# EAGLE design N_MD2_2 (EAGLE 9.6.2)
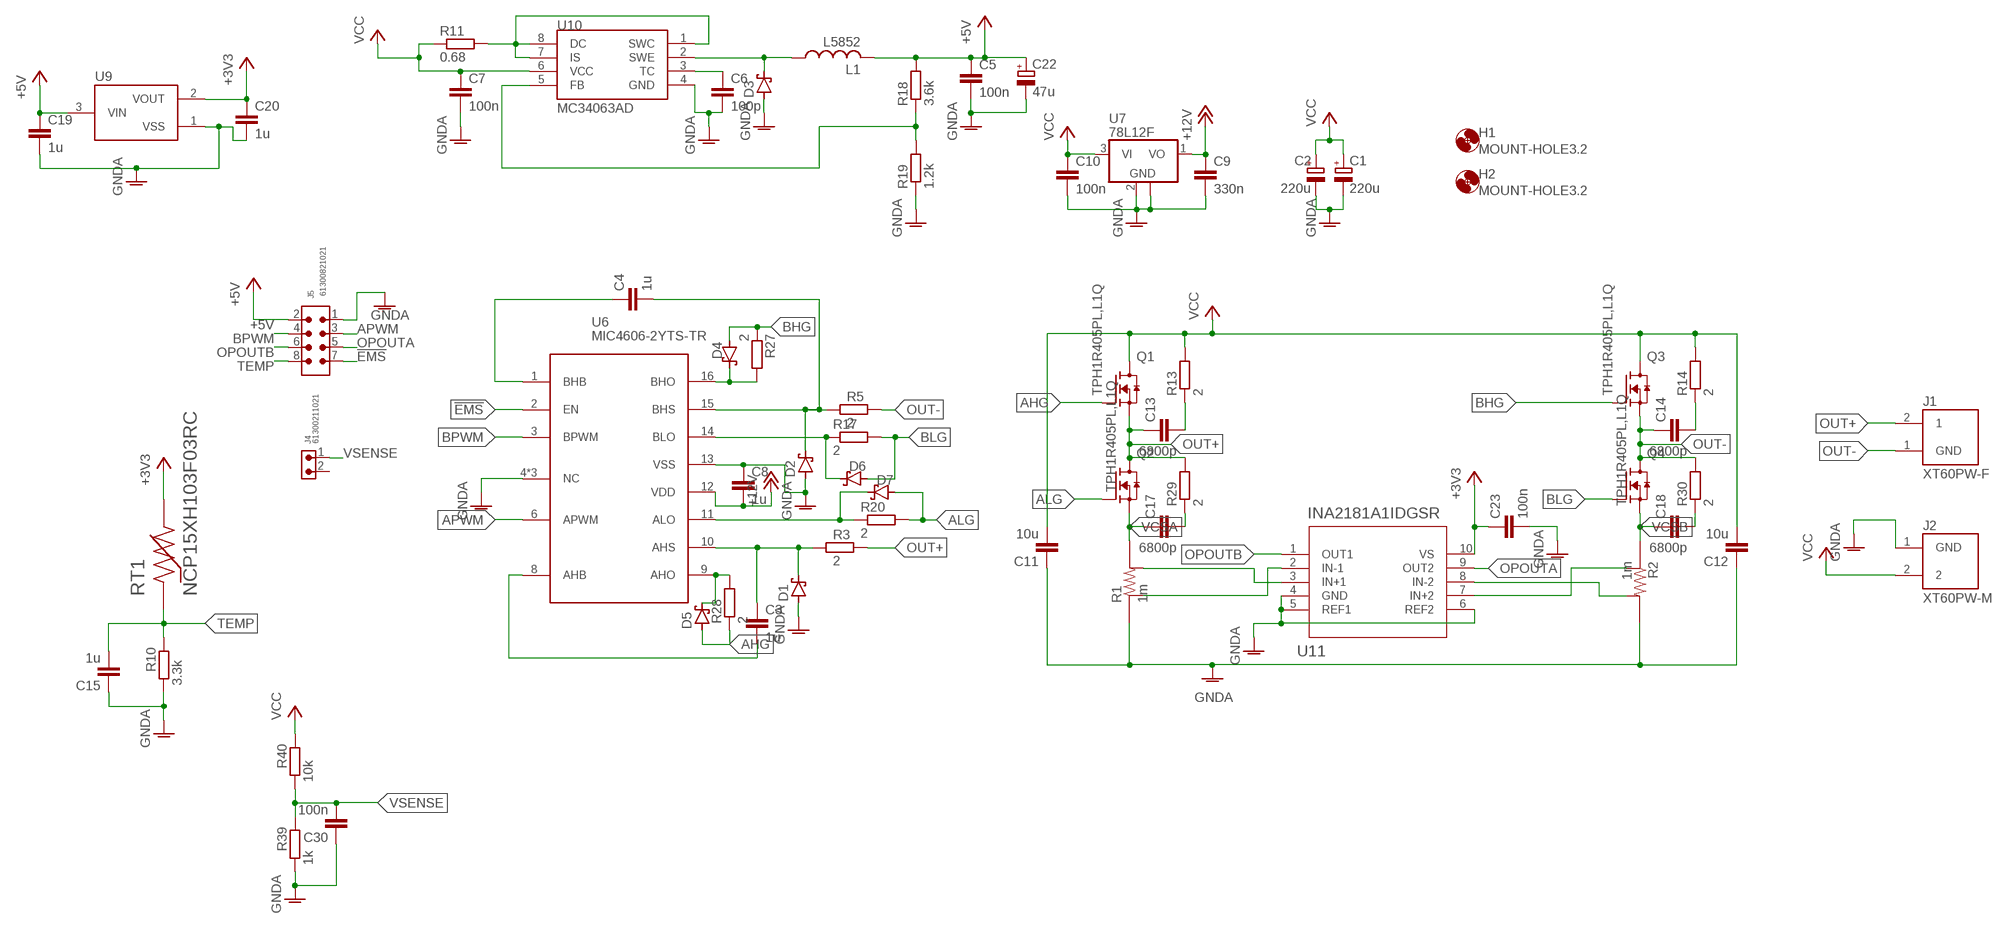
[diagram p0: schematic, sheet 1]

## Parts
C1  220u  CPOL-EUE5-10.5  [E5-10,5]
C2  220u  CPOL-EUE5-10.5  [E5-10,5]
C3  1u  C-EUC0603  [C0603]
C4  1u  C-EUC0603  [C0603]
C5  100n  C-EUC0603  [C0603]
C6  100p  C-EUC0603  [C0603]
C7  100n  C-EUC0603  [C0603]
C8  1u  C-EUC0603  [C0603]
C9  330n  C-EUC0603  [C0603]
C10  100n  C-EUC0603  [C0603]
C11  10u  C-EUC1210  [C1210]
C12  10u  C-EUC1210  [C1210]
C13  6800p  C-EUC0603  [C0603]
C14  6800p  C-EUC0603  [C0603]
C15  1u  C-EUC0603  [C0603]
C17  6800p  C-EUC0603  [C0603]
C18  6800p  C-EUC0603  [C0603]
C19  1u  C-EUC0603  [C0603]
C20  1u  C-EUC0603  [C0603]
C22  47u  CPOL-EUE2.5-5  [E2,5-5]
C23  100n  C-EUC0603  [C0603]
C30  100n  C-EUC0603  [C0603]
D1  PMEG6010CEJ,115  [SOD323_ST]
D2  PMEG6010CEJ,115  [SOD323_ST]
D3  PMEG6010CEJ,115  [SOD323_ST]
D4  PMEG6010CEJ,115  [SOD323_ST]
D5  PMEG6010CEJ,115  [SOD323_ST]
D6  PMEG6010CEJ,115  [SOD323_ST]
D7  PMEG6010CEJ,115  [SOD323_ST]
H1  MOUNT-HOLE3.2  [3,2]
H2  MOUNT-HOLE3.2  [3,2]
J1  XT60PW-F  [AMASS_XT60PW-F]
J2  XT60PW-M  [AMASS_XT60PW-M]
J4  61300211021  6130XX11021_61300211021  [61300211021]
J5  61300821021  6130XX21021_61300821021  [61300821021]
L1  L5852  [L5852]
Q1  TPH1R405PL,L1Q  [SOPADVANCE]
Q2  TPH1R405PL,L1Q  [SOPADVANCE]
Q3  TPH1R405PL,L1Q  [SOPADVANCE]
Q4  TPH1R405PL,L1Q  [SOPADVANCE]
R1  1m  R2512  [2512-4PAD]
R2  1m  R2512  [2512-4PAD]
R3  2  R-EU_R0603  [R0603]
R5  2  R-EU_R0603  [R0603]
R10  3.3k  R-EU_R0603  [R0603]
R11  0.68  R-EU_R1206  [R1206]
R13  2  R-EU_R0603  [R0603]
R14  2  R-EU_R0603  [R0603]
R17  2  R-EU_R0603  [R0603]
R18  3.6k  R-EU_R0603  [R0603]
R19  1.2k  R-EU_R0603  [R0603]
R20  2  R-EU_R0603  [R0603]
R27  2  R-EU_R0603  [R0603]
R28  2  R-EU_R0603  [R0603]
R29  2  R-EU_R0603  [R0603]
R30  2  R-EU_R0603  [R0603]
R39  1k  R-EU_R0603  [R0603]
R40  10k  R-EU_R0603  [R0603]
RT1  NCP15XH103F03RC  [THRMC1005X55N]
U6  MIC4606-2YTS-TR  [TSSOP16]
U7  78L12F  [SOT89]
U9  XC6206  [SOT95P240X110-3]
U10  MC34063AD  [SOIC8]
U11  INA2181A1IDGSR  [DGS10]

## Nets
!EMS: J5.7 U6.2(EN)
+3V3: C20.1 C23.1 RT1.2 U9.2(VOUT) U11.10(VS)
+5V: C5.1 C19.1 C22.+ J5.2 L1.P$2 R18.2 U9.3(VIN)
+12V: C8.2 C9.1 U6.12(VDD) U7.1(VO)
AHG: D5.A Q1.4(G) R28.1
ALG: D7.A Q2.4(G) R20.2
APWM: J5.3 U6.6(APWM)
BHG: D4.A Q3.4(G) R27.1
BLG: D6.A Q4.4(G) R17.2
BPWM: J5.4 U6.3(BPWM)
GNDA: C1.- C2.- C5.2 C6.2 C7.2 C8.1 C9.2 C10.2 C11.1 C12.1 C15.1 C19.2 C20.2 C22.- C23.2 C30.1 D1.A D2.A D3.A J2.1(GND) J5.1 R1.1 R1.2 R2.3 R2.4 R10.1 R19.1 R39.1 U6.4(NC) U6.5(NC) U6.7(NC) U6.13(VSS) U7.2(GND) U7.2@1(GND) U9.1(VSS) U10.4(GND) U11.4(GND) U11.5(REF1) U11.6(REF2)
N$1: C17.2 R29.1
N$2: C18.2 R30.1
N$3: C3.1 D1.C R3.1 U6.10(AHS)
N$4: C3.2 U6.8(AHB)
N$5: C4.2 D2.C R5.1 U6.15(BHS)
N$8: C4.1 U6.1(BHB)
N$18: C14.2 R14.1
N$19: D6.C R17.1 U6.14(BLO)
N$20: C13.2 R13.1
N$21: D7.C R20.1 U6.11(ALO)
N$22: R1.6 U11.3(IN+1)
N$23: R2.5 U11.7(IN+2)
N$26: D3.C L1.P$1 U10.2(SWE)
N$27: C6.1 U10.3(TC)
N$28: R18.1 R19.2 U10.5(FB)
N$29: R2.6 U11.8(IN-2)
N$30: R11.2 U10.1(SWC) U10.7(IS) U10.8(DC)
N$31: R1.5 U11.2(IN-1)
N$32: D4.C R27.2 U6.16(BHO)
N$33: D5.C R28.2 U6.9(AHO)
OPOUTA: J5.5 U11.9(OUT2)
OPOUTB: J5.6 U11.1(OUT1)
OUT+: C13.1 J1.2 Q1.1(S) Q1.2(S) Q1.3(S) Q2.5(D) Q2.6(D) Q2.7(D) Q2.8(D) Q2.9(D) R3.2 R29.2
OUT-: C14.1 J1.1(GND) Q3.1(S) Q3.2(S) Q3.3(S) Q4.5(D) Q4.6(D) Q4.7(D) Q4.8(D) Q4.9(D) R5.2 R30.2
TEMP: C15.2 J5.8 R10.2 RT1.1
VCC: C1.+ C2.+ C7.1 C10.1 C11.2 C12.2 J2.2 Q1.5(D) Q1.6(D) Q1.7(D) Q1.8(D) Q1.9(D) Q3.5(D) Q3.6(D) Q3.7(D) Q3.8(D) Q3.9(D) R11.1 R13.2 R14.2 R40.2 U7.3(VI) U10.6(VCC)
VCSA: C17.1 Q2.1(S) Q2.2(S) Q2.3(S) R1.3 R1.4
VCSB: C18.1 Q4.1(S) Q4.2(S) Q4.3(S) R2.1 R2.2
VSENSE: C30.2 J4.1 R39.2 R40.1
Unconnected: J4.2

## Library data of the parts
C1 C2 C22 = rcl:CPOL-EU: POLARIZED CAPACITOR, European symbol; SPICEPREFIX: C
C3-C15 C17-C20 C23 C30 = rcl:C-EU: CAPACITOR, European symbol; SPICEPREFIX: C
D1-D7 = nexperia:PMEG6010CEJ,115: Schottky barrier diode
H1 H2 = holes:MOUNT-HOLE: MOUNTING HOLE with drill center marker
J1 = con-xt:XT60PW-F
J2 = con-xt:XT60PW-M; AVAILABILITY: Unavailable; MF: AMASS; MP: XT60PW-M; PACKAGE: Package Analog Devices; PRICE: None
J4 = Wurth_Connectors_WR-PHD:6130XX11021_61300211021: WR-PHD 2.54 mm THT Angled Pin Header ARTICLE PROPERTIES: Pins:2;​ 3;​ 4;​ 5;​ 6;​ 7;​ 8;​ 9;​ 10;​ 12;​ 14;​ 16;​ 18;​ 22;​ 32;​ 34;​ 36;​ 40 KIND PROPERTIES: Pitch：2.54 mm Quality Class:3 as per CECC 75 301-802 Rows：Single Gender：Pin Header Type：Angled MATERIAL PROPERTIES: Insulator Material :PA6T Insulator Flammability Rating:UL94 V-0 Contact Material:Copper Alloy Contact Plating:Gold Contact Type:Stamped GENERAL INFORMATION Operating Temperature:-40 up to +105 °C Compliance:Lead free / RoHS ELECTRICAL PROPERTIES: Rated Current:3 A IR 1:3 A Withstanding Voltage:500 V (AC) Contact Resistance:20 mΩ RISO:1000 MΩ CERTIFICATION UL Approval:E323964 PACKAGING PROPERTIES Packaging:Bag <https://katalog.we-online.com/media/images/v2/o33210v209%20Family_WR-PHD_6130xx11021.jpg> Details see: https://katalog.we-online.com/en/em/PHD_2_54_THT_ANGLED_PIN_HEADER_6130XX11021 Updated by Yingchun,Shan 2019-10-16 2019 (C) Würth Elektronik; DATASHEET-URL: https://www.we-online.com/catalog/datasheet/61300211021.pdf; GENDER: Pin Header; IR: 3A; MOUNT: THT; PACKAGING: Bag; PART-NUMBER: 61300211021; PINS: 2; PITCH: 2.54mm; ROWS: Single; TYPE: Angled
J5 = Wurth_Connectors_WR-PHD:6130XX21021_61300821021: WR-PHD 2.54 mm THT Angled Dual Pin Header ARTICLE PROPERTIES: Pins:4;​ 6;​ 8;​ 10;​ 12;​ 14;​ 16;​ 18;​ 20;​ 22;​ 24;​ 26;​ 32;​ 34;​ 36;​ 40;​ 64;​ 72 KIND PROPERTIES: Pitch：2.54 mm Quality Class:3 as per CECC 75 301-802 Rows：Dual Gender：Pin Header Type：Angled;​ Board Stacker MATERIAL PROPERTIES: Insulator Material :PA6T Insulator Flammability Rating:UL94 V-0 Contact Material:Copper Alloy Contact Plating:Gold Contact Type:Stamped GENERAL INFORMATION Operating Temperature:-40 up to +105 °C Compliance:RoHS ELECTRICAL PROPERTIES: Rated Current:3 A IR 1:3 A Withstanding Voltage:500 V (AC) Contact Resistance:20 mΩ RISO:1000 MΩ CERTIFICATION UL Approval:E323964 PACKAGING PROPERTIES Packaging:Bag <https://katalog.we-online.com/media/images/v2/o33214v209%20Family_wr-phd_6130XX21021.jpg> Details see: https://katalog.we-online.com/en/em/PHD_2_54_THT_ANGLED_DUAL_PIN_HEADER_6130XX21021 Updated by Yingchun,Shan 2019-10-16 2019 (C) Würth Elektronik; DATASHEET-URL: https://www.we-online.com/catalog/datasheet/61300821021.pdf; GENDER: Pin Header; IR: 3A; MOUNT: THT; PACKAGING: Bag; PART-NUMBER: 61300821021; PINS: 8; PITCH: 2.54mm; ROWS: Dual; TYPE: Angled
L1 = inductors:L5852
Q1-Q4 = toshiba:TPH1R405PL,L1Q
R1 R2 = shunt-resistor:R2512
R3 R5 R10 R11 R13 R14 R17-R20 R27-R30 R39 R40 = rcl:R-EU_: RESISTOR, European symbol; SPICEPREFIX: R
RT1 = NCP15XH103F03RC:NCP15XH103F03RC: NTC Thermistor 10k 0402 (1005 Metric) Check prices <https://pricing.snapeda.com/parts/NCP15XH103F03RC/Murata/view-part?ref=eda>; AVAILABILITY: Good; DESCRIPTION: NTC Thermistor 10k 0402 (1005 Metric); MF: Murata; MP: NCP15XH103F03RC; PACKAGE: 1005 Taiyo Yuden; PRICE: None; PURCHASE-URL: https://pricing.snapeda.com/search/part/NCP15XH103F03RC/?ref=eda
U6 = Microchip:MIC4606-2YTS-TR
U7 = linear:78L*: POSITOIV-VOLTAGE REGULATORS Output up to 100 mA Source: Datasheet <http://focus.ti.com/lit/ds/symlink/ua78l05.pdf>
U9 = torex:XC6206
U10 = mc34063:MC34063
U11 = texas-instruments:INA2181A1IDGSR; BUILT_BY: EMA_Jessica; COPYRIGHT: Copyright (C) 2018 Accelerated Designs. All rights reserved; MANUFACTURER_PART_NUMBER: INA2181A1IDGSR; VENDOR: Texas Instruments

## Board
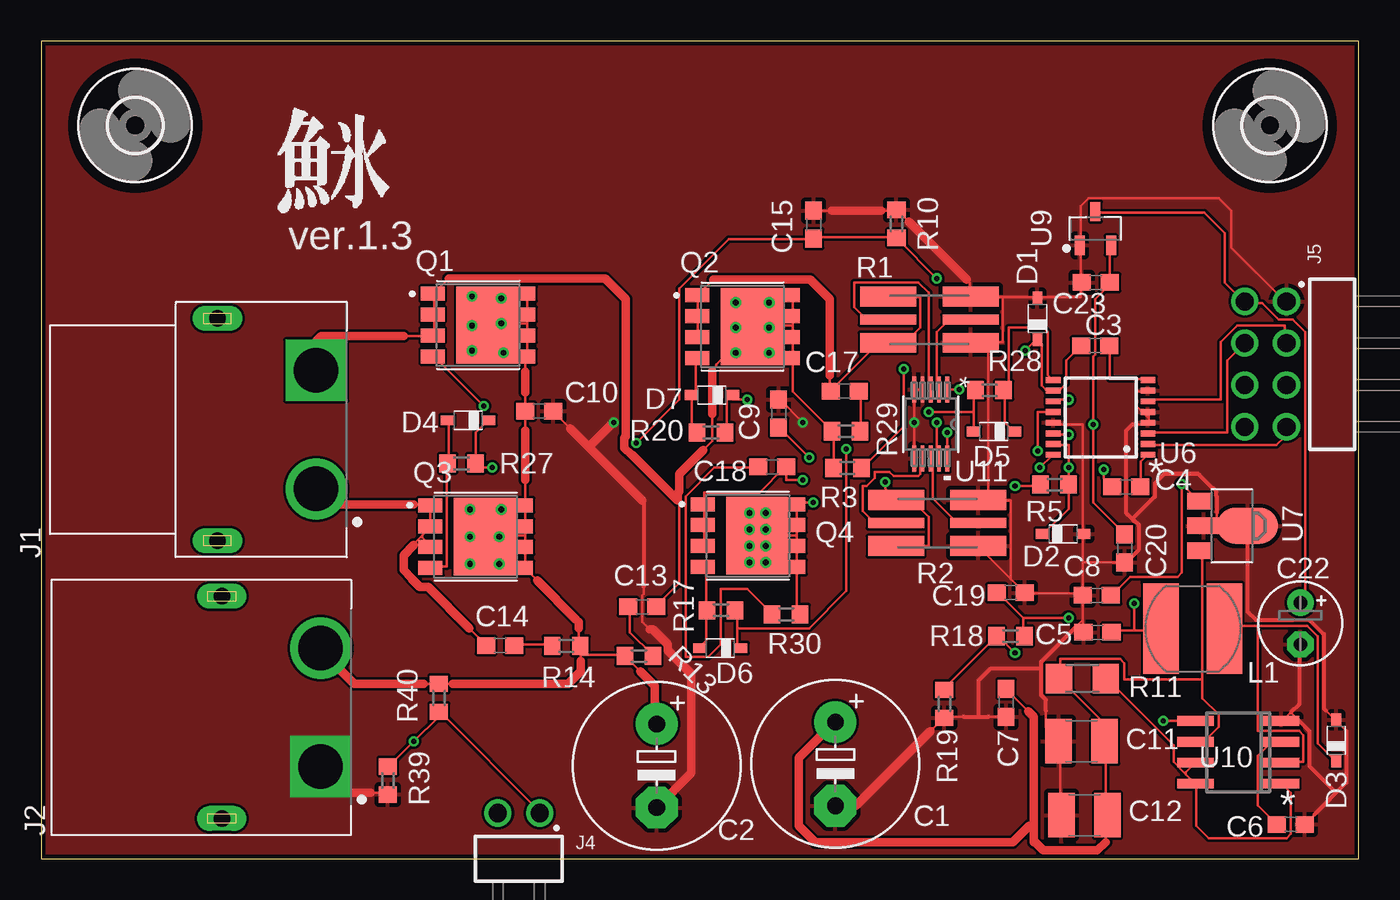
[diagram p1: board, top side]
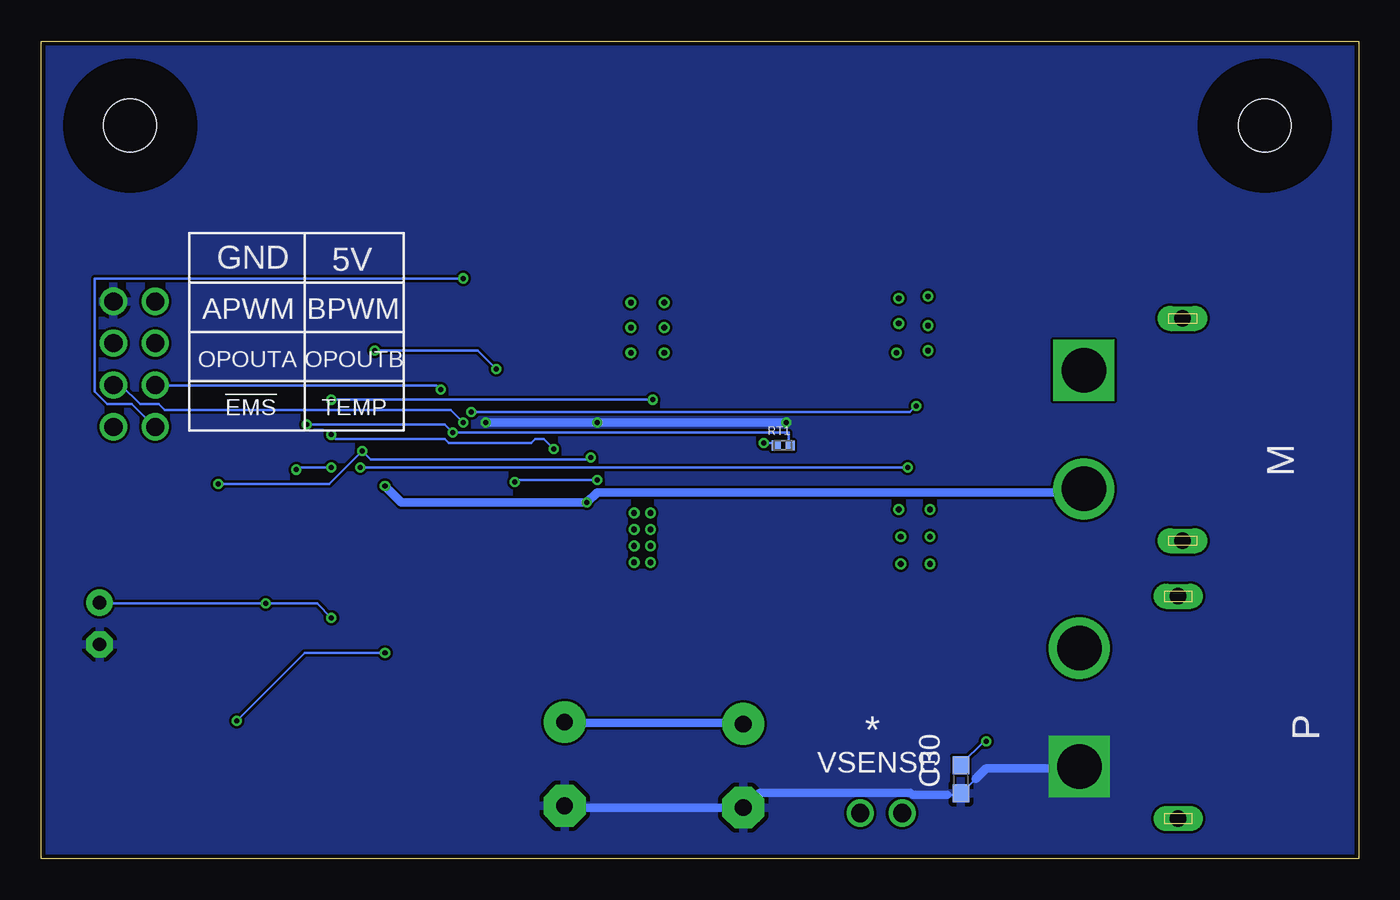
[diagram p2: board, bottom side, seen from below]

Size 80 x 49.66 mm. Coordinates in mm from the lower left corner, seen from the top.
Outline: 0,0 80,0 80,49.66 0,49.66 0,0
Copper layers (1*16): Top 0.035mm / dielectric 1.5mm / Bottom 0.035mm
Design rules "SeeedStudio_2layer_DRU_no_angle_20140221": minimum track width 6mil, minimum drill 12mil, track to track 6mil, track to pad 6mil, pad to pad 6mil, via to via 6mil, smd to smd 0mil, copper to edge 10mil, drill to drill 10mil, minimum pad ring 10mil, minimum via ring 6mil, stop-mask expansion 2mil, vias tented up to drill 100mil, thermal gap 10mil

### Footprints (pad centres in the part's own frame; a part is rotated, then mirrored left to right if it is on the bottom)
E5-10,5 = drill 1.016 pad 2.54: + -2.54,0 | drill 1.016 pad 2.54 octagon: - 2.54,0
C0603 = smd 1.1 x 1: 1 -0.85,0; 2 0.85,0
C1210 = smd 1.6 x 2.7: 1 -1.4,0; 2 1.4,0
E2,5-5 = drill 0.813 pad 1.6: + -1.27,0 | drill 0.813 pad 1.6 octagon: - 1.27,0
SOD323_ST = smd 0.8 x 0.6: A 1.25,0; C -1.25,0
3,2 = hole 3.2: 0,0
AMASS_XT60PW-F = drill 2.7: 1 -3.6,-6 | drill 2.7 square: 2 3.6,-6 | drill 1 pad 1.2 long: S1 -6.75,0; S2 6.75,0
AMASS_XT60PW-M = drill 2.7 square: 1 -3.6,-6 | drill 2.7: 2 3.6,-6 | drill 1 pad 1.2 long: S1 -6.75,0; S2 6.75,0
61300211021 = drill 1.1: 1 1.27,2.77; 2 -1.27,2.77
61300821021 = drill 1.1: 1 3.81,2.77; 2 3.81,5.31; 3 1.27,2.77; 4 1.27,5.31; 5 -1.27,2.77; 6 -1.27,5.31; 7 -3.81,2.77; 8 -3.81,5.31
L5852 = smd 2.15 x 5.5: P$1 1.925,0; P$2 -1.925,0
SOPADVANCE = smd 1.45 x 0.85: 1 -2.75,1.905; 2 -2.75,0.635; 3 -2.75,-0.635; 4 -2.75,-1.905 | smd 1.05 x 0.85: 5 2.95,-1.905; 6 2.95,-0.635; 7 2.95,0.635; 8 2.95,1.905 | smd 3.75 x 4.7: 9 0.55,0
2512-4PAD = smd 3.4 x 1.2: 1 -2.5,1.4; 2 -2.5,-1.4; 3 2.5,1.4; 4 2.5,-1.4 | smd 3.4 x 0.6: 5 -2.5,0; 6 2.5,0
R0603 = smd 1 x 1.1: 1 -0.85,0; 2 0.85,0
R1206 = smd 1.6 x 1.803: 1 -1.422,0; 2 1.422,0
THRMC1005X55N = smd 0.54 x 0.6: 1 -0.432,0; 2 0.432,0
TSSOP16 = smd 0.9 x 0.35: 1 -2.875,2.275; 2 -2.875,1.625; 3 -2.875,0.975; 4 -2.875,0.325; 5 -2.875,-0.325; 6 -2.875,-0.975; 7 -2.875,-1.625; 8 -2.875,-2.275; 9 2.875,-2.275; 10 2.875,-1.625; 11 2.875,-0.975; 12 2.875,-0.325; 13 2.875,0.325; 14 2.875,0.975; 15 2.875,1.625; 16 2.875,2.275
SOT89 = smd 1 x 1.5: 1 -1.499,-1.981; 3 1.499,-1.981 | smd 1 x 2: 2 0,-1.727 | smd 2.2 x 3.7: 2@1 0,0.94
SOT95P240X110-3 = smd 1.18 x 0.609: 1 -1.024,0.95; 2 -1.024,-0.95; 3 1.024,0
SOIC8 = smd 0.6 x 2.2: 1 -1.905,-2.6; 2 -0.635,-2.6; 3 0.635,-2.6; 4 1.905,-2.6; 5 1.905,2.6; 6 0.635,2.6; 7 -0.635,2.6; 8 -1.905,2.6
DGS10 = smd 1.575 x 0.229: 1 -2.095,1; 2 -2.095,0.5; 3 -2.095,0; 4 -2.095,-0.5; 5 -2.095,-1; 6 2.095,-1; 7 2.095,-0.5; 8 2.095,0; 9 2.095,0.5; 10 2.095,1

### Placement (x,y rotation side)
C1  48.22,5.75 270 top
C2  37.37,5.64 270 top
C3  63.99,31.15 0 top
C4  65.88,22.58 180 top
C5  64.14,13.76 180 top
C6  75.86,2.07 0 top
C7  58.58,9.47 270 top
C8  64.09,15.99 0 top
C9  44.78,27.04 90 top
C10  30.25,27.18 0 top
C11  63.17,7.13 0 top
C12  63.34,2.64 0 top
C13  36.5,15.29 180 top
C14  27.87,12.94 0 top
C15  46.89,38.51 270 top
C17  48.78,28.39 0 top
C18  44.39,23.8 180 top
C19  58.87,16.15 0 top
C20  65.79,18.83 270 top
C22  76.45,14.28 270 top
C23  64.03,34.99 180 top
C30  24.16,4.82 90 bottom
D1  60.49,32.8 90 top
D2  62.04,19.73 0 top
D3  78.62,7.19 90 top
D4  25.92,26.63 180 top
D5  57.85,25.95 180 top
D6  41.23,12.79 180 top
D7  40.72,28.17 180 top
H1  74.6,44.53 0 top
H2  5.71,44.53 0 top
J1  10.7,26.06 90 top
J2  10.97,9.19 90 top
J4  29,0 0 top
J5  78.38,30.04 90 top
L1  69.91,13.97 0 top
Q1  26.53,32.42 0 top
Q2  42.58,32.32 0 top
Q3  26.38,19.56 0 top
Q4  42.92,19.62 0 top
R1  53.93,32.74 180 top
R2  54.41,20.39 0 top
R3  48.94,23.74 180 top
R5  61.53,22.72 180 top
R10  51.93,38.56 270 top
R11  63.21,10.94 0 top
R13  36.29,12.31 180 top
R14  31.88,12.93 0 top
R17  41.28,15.09 180 top
R18  58.85,13.52 0 top
R19  54.84,9.4 90 top
R20  40.67,25.88 180 top
R27  25.52,24.01 0 top
R28  57.58,28.46 0 top
R29  48.86,25.96 180 top
R30  45.23,14.84 0 top
R39  21.05,4.74 90 top
R40  24.15,9.77 90 top
RT1  34.95,25.09 0 bottom
U6  64.32,26.81 180 top
U7  72.31,20.21 270 top
U9  64.01,38.28 90 top
U10  72.68,6.47 90 top
U11  54.01,26.39 270 top

### Tracks (layer width: path | path; a pad name or v marks a point on that pad's centre or on a via)
!EMS
  Top 0.152: U6.2 67.25,25.12 75,25.12 75.5,25.62 75.5,26.12 J5.7
+3V3  (via drill 0.3)
  Top 0.152: U9.2 64.88,37.25 C23.1 64.88,34.88 64,34 64,30.62 63.88,30.5 v63.88,26.38 63.88,21.62 65.75,19.75 C20.1 | v55,25.88 55,24.38 U11.10
  Bottom 0.152: v63.88,26.38 55.5,26.38 v55,25.88 34.62,25.88 34.62,25.2 RT1.2
+5V  (via drill 0.3)
  Top 0.152: U9.3 64.12,39.25 70.62,39.25 71.88,38 71.88,35 73,33.88 J5.2 73.12,33.75 74.12,33.75 75.12,32.75 76,32.75 76.75,32 76.75,15.88 76.5,15.62 C22.+ | 66.38,13.88 67.88,13.88 L1.P$2 | 66.38,13.88 65,13.88 C5.1 | 59.62,14.62 58.12,16.12 C19.1 | 59.62,14.62 59.62,13.62 R18.2 | v62.38,14.62 59.62,14.62 | v66.38,15.5 66.38,13.88
  Bottom 0.152: v62.38,14.62 63.25,15.5 v66.38,15.5 76.38,15.5 C22.+
+12V  (via drill 0.3)
  Top 0.152: v60.5,24.75 60.5,27.12 61.38,27.12 U6.12 | U7.1 70.25,21.75 v69.25,22.75 69.25,17.38 69,17.12 66.12,17.12 65,16 C8.2 | v46.62,24.38 44.88,26.12 C9.1
  Bottom 0.152: v69.25,22.75 62.5,22.75 v60.5,24.75 60,24.25 46.75,24.25 v46.62,24.38
AHG  (via drill 0.3)
  Top 0.152: 56.62,27.12 56.62,28.38 R28.1 | 56.62,27.12 56.62,26 D5.A | v26.88,27.5 23.88,30.5 Q1.4 | 56.62,27.12 v53.88,27.12
  Bottom 0.152: v26.88,27.5 27.25,27.12 v53.88,27.12
ALG
  Top 0.152: Q2.4 39.75,30.38 39.75,28.5 39.5,28.25 D7.A 39.5,28.12 39.5,26.25 39.75,26 R20.2
APWM
  Top 0.152: U6.6 67.25,27.88 71.62,27.88 71.62,31.38 72.62,32.38 75.5,32.38 75.5,31.38 J5.3
BHG
  Top 0.152: D4.A 24.75,26.62 24.75,24.12 R27.1 24.62,24 24.62,17.75 23.75,17.75 Q3.4
BLG
  Top 0.152: D6.A 40,12.88 40.38,13.25 40.38,15 R17.2 40.38,15.12 40.38,17.5 40.25,17.62 Q4.4
BPWM
  Top 0.152: U6.3 67.25,25.88 72,25.88 72,30.25 73,31.25 J5.4
GNDA  (via drill 0.3)
  Top 0.152: 20,4 21,4 R39.1 | v46.25,26.5 44.88,27.88 C9.2 | U11.6 53,24.38 v53,26.5 53,28.38 U11.5 U11.4 | 36.5,21.75 33.25,25 32.12,26.12 31.12,27.12 C10.2 | 36.94,13.94 36.5,14.38 36.5,16 36.58,16.08 36.58,16.51 | 37.38,3.12 C2.- | 34.62,26.38 v34.75,26.5 | 51,39.38 51.88,39.38 R10.1 52,39.38 52.69,38.69 | 48,39.38 47,39.38 C15.1 | 56.19,35.19 56.38,35 56.38,34.25 R1.2 56.5,34.12 58.38,34.12 | 58.38,34.12 60.38,34.12 D1.A 60.5,34.12 63.12,34.12 63.12,34.88 C23.2 63.12,35 63.12,37.25 U9.1 63.12,37.38 63.12,39.64 63.61,40.12 64,40.12 71.5,40.12 72.25,39.38 72.25,37.12 75.5,33.88 J5.1 | 57.5,31.38 58.38,31.38 58.38,34.12 | 57.5,31.38 56.5,31.38 R1.1 57.5,31.38 | C7.2 58.5,8.62 57.53,8.62 57,8.62 56,8.62 54.88,8.62 R19.1 54.75,8.5 54.12,7.88 | 79.25,7.75 78.62,8.38 D3.A 78.5,8.5 78,9 | 78.62,4 77.31,2.69 76.75,2.12 C6.2 | 78.62,4 79.25,4.62 | U10.4 75.38,8.38 75.88,8.88 76.88,7.88 | 78.59,4.04 78.62,4 | C12.1 61.88,2.75 61.88,7.12 C11.1 61.75,7.25 61,8 61,9 | 71.38,20.25 73.12,20.25 U7.2@1 73.25,20.12 73.25,20 | 71.38,20.25 70.62,20.25 U7.2 71.38,20.25 | 67.25,26.75 67.25,27.12 U6.5 | 67.25,26.75 67.25,26.5 U6.4 67.12,26.38 66.42,26.38 | 67.25,26.75 66.5,27.5 66.5,28.38 67.12,28.38 U6.7 | 63.25,16.12 C8.1 | 63.25,16.12 63.25,18 | 63.25,18 63.25,19.62 D2.A 63.25,19.75 63.25,26.38 61.5,26.38 U6.13 | 63.25,14.5 63.25,15.88 C8.1 | 63.25,14.5 63.25,13.88 C5.2 | 63.25,16.12 59.75,16.12 C19.2 59.62,16.25 58.88,17 | 63.25,16.12 C8.1 | 63.25,18 65.75,18 C20.2 65.88,18 65.94,18.06 | 65.88,25.91 65.88,26 | 66.62,20.25 66.25,20.62 | 66.25,20.62 65.94,20.94 65.88,21 | 58.88,17 57,18.88 R2.4 | 57.5,21.75 58.88,21.75 58.88,17
  Top 0.152: 57.5,21.75 57,21.75 R2.3 57.5,21.75 | 71.38,22 71.38,22.25 70.31,23.31 | 71.38,21 71.38,20.25 | 66.31,20.69 66.25,20.62 | 62.88,14.12 63.25,14.5 | 76,14.5 77,14.5 | 57.5,21.75 57.5,31.38
  Top 0.254: 61,9 61,9.64 60.71,9.93 60.71,11.56 | 60.71,11.56 60.71,11.96 62.88,14.12 | 57,8.62 56.9,8.73 56.9,10.79 57.66,11.56 60.71,11.56 | 56,8.62 57.53,8.62 | 53.99,7.74 54.12,7.88 | 75.88,8.88 76.38,9.38 76.38,12.94 C22.- | U10.4 76.38,8.37 76.88,7.88 77,7.75 77,5.62 78.59,4.04 | 77.31,2.69 79.25,4.62 79.25,7.75 | 78,9 77.88,9.12 77.88,13.63 77,14.5 | 73.25,20 73.25,15 73.76,14.49 75.99,14.49 76,14.5 | 71.38,21 71.38,22 71.35,22.02 71.35,22.33 71.19,22.49 71.13,22.49 70.31,23.31 70.25,23.38 68.2,23.38 67.62,22.8 67.62,22 66.31,20.69 | 65.94,20.94 66.36,20.51 66.4,20.51 66.62,20.29 66.62,20.25 66.62,18.75 65.94,18.06 | 65.88,21 65.88,25.91 | 65.88,26 66.25,26.38 66.42,26.38 | 36.5,21.75 36.58,21.67 36.58,16.51
  Top 0.508: 56.19,35.19 52.69,38.69 | 48,39.38 51,39.38 | J2.1 18.55,4 20,4 | 36.94,13.94 37.14,13.94 38.05,13.03 38.05,12.64 39.48,11.22 39.48,5.21 37.4,3.12 37.38,3.12 | 36.5,21.75 32.12,26.12 | 33.25,25 34.62,26.38 | C1.- 49.46,3.21 53.99,7.74
  Bottom 0.152: 23.27,4.86 24.12,4 C30.1 24.25,3.88 25,3.88 | 37.19,3.19 37.25,3.12 C2.- | 48.12,3.12 48,3.12
  Bottom 0.508: v34.75,26.5 v46.25,26.5 v53,26.5 | J2.1 17.05,5.5 22.62,5.5 23.27,4.86 | 25,3.88 27.09,3.88 27.22,4 36.37,4 37.19,3.19 | C2.- 47.97,3.1 48,3.12 | C1.- 48.13,3.12 48.12,3.12
  pour Bottom: 0,50 0,0 80,0 80,50 1,50
  pour Top: 0,50 0,0 80,0 80,50
N$1
  Top 0.152: R29.1 49.75,26 49.75,28.38 C17.2
N$2
  Top 0.152: R30.1 44.38,14.88 42.88,16.38 41.25,16.38 41.25,13 40.5,12.25 39.12,12.25 39.12,22 40.88,23.75 43.5,23.75 C18.2
N$3  (via drill 0.3)
  Top 0.152: v52.38,29.75 52.38,26.25 49.88,23.75 R3.1 | v59.75,30.88 60.38,31.5 D1.C 60.5,31.5 60.75,31.25 60.75,28.75 61,28.5 61.38,28.5 U6.10 61.5,28.5 61.88,28.5 62.25,28.88 62.25,30.25 63.12,31.12 C3.1
  Bottom 0.152: v52.38,29.75 53.5,30.88 v59.75,30.88
N$4
  Top 0.152: U6.8 67.12,29.12 64.88,29.12 64.88,31.12 C3.2
N$5  (via drill 0.3)
  Top 0.152: D2.C 60.88,19.75 62.38,21.25 62.38,22.62 R5.1 62.38,22.75 v62.38,23.75 62.38,25.12 61.5,25.12 U6.15 | v64.5,23.62 64.5,23.12 65,22.62 C4.2
  Bottom 0.152: v64.5,23.62 64.38,23.75 v62.38,23.75
N$6  (via drill 0.35)
  other vias: 43,18
N$7  (via drill 0.35)
  other vias: 44,18
N$8
  Top 0.152: U6.1 67.12,24.5 66.75,24.12 66.75,22.62 C4.1
N$9  (via drill 0.35)
  other vias: 43,19
N$10  (via drill 0.35)
  other vias: 44,19
N$11  (via drill 0.35)
  other vias: 43,20
N$12  (via drill 0.35)
  other vias: 44,20
N$13  (via drill 0.35)
  other vias: 43,21
N$14  (via drill 0.35)
  other vias: 44,21
N$15  (via drill 0.35)
  other vias: 44.2,30.73
N$16  (via drill 0.35)
  other vias: 42.16,30.73
N$17  (via drill 0.35)
  other vias: 42.16,32.26
N$18
  Top 0.152: C14.2 28.75,13 31,13 R14.1
N$19  (via drill 0.3)
  Top 0.152: 42.25,14 42.25,15 R17.1 | 42.25,14 42.25,13 42.38,12.88 D6.C | v62.38,25.75 61.5,25.75 U6.14 | v48.88,24.88 48.88,16.25 46.62,14 42.25,14
  Bottom 0.152: v62.38,25.75 62.12,25.5 55.5,25.5 55.25,25.25 50.25,25.25 50,25.5 49.5,25.5 v48.88,24.88
N$20
  Top 0.152: R13.1 37.12,12.38 35.75,13.75 35.75,15.25 C13.2
N$21  (via drill 0.3)
  Top 0.152: R20.1 41.62,26 41.62,27.88 41.88,28.12 D7.C 42,28.12 42,27.88 v42.88,27.88 | v62.38,27.88 61.5,27.88 U6.11
  Bottom 0.152: v42.88,27.88 v62.38,27.88
N$22
  Top 0.152: U11.3 53.88,28.62 53.88,34.38 53.25,35 49.38,35 49.38,33.5 50.12,32.75 51.38,32.75 R1.6
N$23
  Top 0.152: U11.7 53.5,24.25 53.38,24.12 53.38,23.38 53.25,23.25 51.75,23.25 51.5,23.5 50.62,23.5 50.62,23.12 50.12,22.62 49.88,22.62 49.88,21.12 50.5,20.5 51.88,20.5 R2.5
N$24  (via drill 0.35)
  other vias: 42.16,33.78
N$25  (via drill 0.35)
  other vias: 44.2,33.78
N$26
  Top 0.152: 73.88,14.12 71.88,14.12 71.88,14 L1.P$1 | 73.88,14.12 76.88,14.12 77.5,13.5 77.5,7 78.5,6 D3.C | 73.88,14.12 73.88,7.75 76.38,7.75 76.62,7.5 76.62,5.88 75.38,5.88 U10.2
N$27
  Top 0.152: C6.1 75,2.12 73.88,3.25 73.88,6.25 74.62,7 75.25,7 U10.3
N$28  (via drill 0.3)
  Top 0.152: R19.2 54.88,10.38 58,13.5 R18.1 58.12,13.5 v59.12,12.5 | v68.12,8.38 70,8.38 U10.5
  Bottom 0.152: v68.12,8.38 64,12.5 v59.12,12.5
N$29
  Top 0.152: U11.8 54,24.25 54.12,24.12 54.12,21.88 55.5,20.5 56.88,20.5 R2.6
N$30
  Top 0.152: 69.5,5.12 70,4.62 U10.8 70.12,4.5 70.12,2 70.88,1.25 75.62,1.25 75.88,1.5 75.88,4 75.38,4.5 U10.1 | 69.5,5.12 68.75,5.88 68.75,6.88 64.75,10.88 R11.2 | U10.7 69.5,5.25 69.5,5.12
N$31
  Top 0.152: U11.2 54.38,28.62 54.38,32 55,32.62 56.38,32.62 R1.5
N$32  (via drill 0.3)
  Top 0.152: D4.C 27.12,26.62 26.38,25.88 26.38,24.12 R27.2 26.38,23.75 v27.38,23.75 | v60.62,23.75 61.38,24.5 U6.16
  Bottom 0.152: v27.38,23.75 v60.62,23.75
N$33
  Top 0.152: D5.C 59,26 58.5,26.5 58.5,28.38 R28.2 58.5,28.5 58.75,28.75 58.75,32.25 60.88,32.25 61.12,32 61.12,29.38 61.38,29.12 U6.9
N$34  (via drill 0.35)
  other vias: 44.2,32.26
N$35  (via drill 0.35)
  other vias: 28.07,30.73
N$36  (via drill 0.35)
  other vias: 26.16,30.86
N$37  (via drill 0.35)
  other vias: 26.16,32.38
N$38  (via drill 0.35)
  other vias: 27.94,32.51
N$39  (via drill 0.35)
  other vias: 27.94,34.04
N$40  (via drill 0.35)
  other vias: 26.16,34.16
N$41  (via drill 0.35)
  other vias: 27.81,17.91
N$42  (via drill 0.35)
  other vias: 26.04,17.91
N$43  (via drill 0.35)
  other vias: 26.04,19.56
N$44  (via drill 0.35)
  other vias: 27.81,19.56
N$45  (via drill 0.35)
  other vias: 27.94,21.21
N$46  (via drill 0.35)
  other vias: 26.04,21.21
OPOUTA  (via drill 0.3)
  Top 0.152: v54.38,26.5 54.38,24.5 54.5,24.38 U11.9
  Bottom 0.152: v54.38,26.5 55.12,27.25 72.5,27.25 72.88,27.62 74,27.62 75.12,28.75 75.5,28.75 J5.5
OPOUTB  (via drill 0.3)
  Top 0.152: v55.75,28.5 U11.1
  Bottom 0.152: v55.75,28.5 56,28.75 73,28.75 J5.6
OUT+
  Top 0.152: 22,31.75 23.75,31.75 Q1.3 23.88,31.88 23.88,33 Q1.2 23.88,33.12 23.88,34.25 Q1.1 23.88,34.38 24.75,35.25 | R3.2 48.12,23.75 48.12,25.88 R29.2 48,26 45.62,28.38 45.62,30.38 Q2.5 45.62,30.5 45.62,31.62 Q2.6 45.62,31.75 45.62,32.38 | Q2.8 45.62,34.12 45.62,33 Q2.7 45.62,32.88 45.62,32.38 | 38.75,23.38 38.75,16.75 37.38,15.38 C13.1 | 40.19,24.81 40.75,25.38 40.75,27 | 45.62,32.38 43.25,32.38 Q2.9 43.12,32.25 43.12,32.12 41,30 41,29.86 40.75,29.61
  Top 0.508: J1.2 16.7,31.45 17,31.75 22,31.75 | 24.75,35.25 34.25,35.25 35.5,34 35.5,25.63 35.41,25.55 35.41,24.95 35.83,24.54 35.85,24.54 38.64,21.75 38.64,22.2 38.75,22.31 38.75,23.38 40.19,24.81 | 40.75,27 40.75,29.61
OUT-  (via drill 0.3)
  Top 0.152: R30.2 46,14.88 45.88,15 45.88,17.62 Q4.5 45.88,17.75 45.88,18.88 Q4.6 45.88,19.62 | v59.12,22.62 60.62,22.62 R5.2 | v46.88,21.62 45.88,21.62 Q4.8 45.88,21.5 45.88,20.38 Q4.7 45.88,19.62 | 45.88,19.62 43.5,19.62 Q4.9 | 26,14 27,13 C14.1 | 22.62,19.05 22.62,19.12 23.12,19.62 | 23.12,19.62 23.62,20.12 Q3.2 23.62,20.25 23.62,21.38 Q3.1 23.62,21.5 22.61,21.5 | 23.12,19.62 23.12,19.5 23.62,19 Q3.3
  Top 0.508: J1.1 17.66,21.5 22.61,21.5 | 26,14 23.5,16.5 23,16.5 22.5,17 22.5,17.03 22,17.53 22,18.43 22.62,19.05
  Bottom 0.508: J1.1 16.91,22.25 46.25,22.25 v46.88,21.62 58.12,21.62 v59.12,22.62
TEMP  (via drill 0.3)
  Top 0.152: v36.12,25.25 38.75,27.88 38.75,34.62 41.75,37.62 46.88,37.62 C15.2 47,37.75 51.88,37.75 R10.2 52,37.62 v54.38,35.25
  Bottom 0.152: v36.12,25.25 35.62,25.25 35.5,25.12 RT1.1 | v54.38,35.25 76.75,35.25 76.75,28.38 76,27.62 74.5,27.62 73.12,26.25 J5.8
VCC
  Top 0.152: 70.5,10.88 70.5,9.75 71.5,8.75 71.5,8 70.62,7.12 70.12,7.12 U10.6 | 70.5,10.88 70.5,18.5 70.38,18.62 U7.3 | 59.94,8.94 58.62,10.25 C7.1 | 64.62,1 64.62,2.62 C12.2 64.62,2.75 64.62,7.12 C11.2 64.5,7.25 64.5,8.25 61.88,10.88 R11.1 61.88,11 61.88,12.12 65.5,12.12 65.75,11.88 65.75,10.88 70.5,10.88 | 29.38,19.62 29.38,20.12 Q3.7 29.38,20.25 29.38,21.38 Q3.8 29.38,21.5 29.38,23 | 29.38,19.62 29.38,19 Q3.6 29.38,18.88 29.38,17.75 Q3.5 29.38,17.62 30.1,16.9 | 29.38,19.62 27,19.62 Q3.9 | Q1.8 29.5,34.25 29.5,33.12 Q1.7 29.5,33 29.5,32.5 | 29.38,29.59 29.38,30.5 Q1.5 29.5,30.62 29.5,31.75 Q1.6 29.5,31.88 29.5,32.5 | 29.38,28.32 29.38,27.25 C10.1 29.38,27.12 29.38,26 | 29.5,32.5 27.12,32.5 Q1.9 | 23.24,10.62 24.12,10.62 R40.2 24.25,10.62 25,10.62 | 32.75,12.38 35.38,12.38 R13.2 35.5,12.25 36.38,11.37 | 32.75,12.38 32.75,12.88 R14.2 32.62,13 32.62,14 | 32.75,12 32.75,12.38 | 32.5,14.5 32.62,14.38 | 48.12,8.25 C1.+
  Top 0.508: J2.2 16.97,12.66 19,10.62 23.24,10.62 | 25,10.62 32,10.62 32.75,11.38 32.75,12 | 32.5,14.5 30.1,16.9 | 32.62,14.38 32.62,14 | 29.38,23 29.38,26 | 29.38,28.32 29.38,29.59 | 60.25,2 60.25,1 60.34,1 60.83,0.51 64.13,0.51 64.62,1 | 60.25,2 60.25,8.62 59.94,8.94 | 60.25,2 60,2 59,1 47,1 46,2 46,6.12 48.12,8.25 | C2.+ 37.25,8.3 37.25,10.5 36.38,11.37
  Bottom 0.152: 48.12,8.25 C1.+
  Bottom 0.508: C2.+ 37.44,8.25 48.12,8.25
VCSA
  Top 0.152: Q2.3 39.88,31.75 39.88,32.88 Q2.2 39.88,33 39.88,34.12 Q2.1 39.88,34.25 40.81,35.19 | 47.88,29.34 47.88,28.5 C17.1 48,28.5 50.75,31.25 51.38,31.25 R1.3 51.5,31.38 52.5,31.38 53.38,32.25 53.38,34.12 51.5,34.12 R1.4
  Top 0.508: 40.81,35.19 46.69,35.19 47.88,34 47.88,29.34
VCSB  (via drill 0.3)
  Top 0.152: R2.2 52,19 53.88,19 53.88,20.75 52.88,21.75 52,21.75 R2.1 51.88,21.88 51.25,22.5 v51.25,22.88 | Q4.3 40.25,19 40.25,20.25 Q4.2 40.25,20.38 40.25,21.5 Q4.1 40.25,21.62 40.25,22.25 43.62,22.25 45.12,23.75 C18.1 45.25,23.75 45.25,23 v46.25,23
  Bottom 0.152: v51.25,22.88 51.12,23 v46.25,23
VSENSE  (via drill 0.3)
  Top 0.152: R39.2 21.12,5.62 v22.62,7.12 24.12,8.62 24.12,8.88 R40.1 24.25,8.88 30.25,2.88 J4.1
  Bottom 0.152: v22.62,7.12 22.75,7.12 24.12,5.75 C30.2

### Text on the board
tPlace: ver.1.3 | * | *
bPlace: 5V | GND | BPWM | APWM | OPOUTB | OPOUTA | TEMP | !EMS | M | P | * | VSENSE